# EasyEDA Pro project ProPrj_MegaPocket_2025-07-17.epro, schematic Schematic1
Board Name: PCB2; Create Date: 2025-07-09; Page Name: P1; Project Name: MegaPocket_2025-05-22; Schematic Name: Schematic1; Update Date: 2025-07-10; Version: V2.0
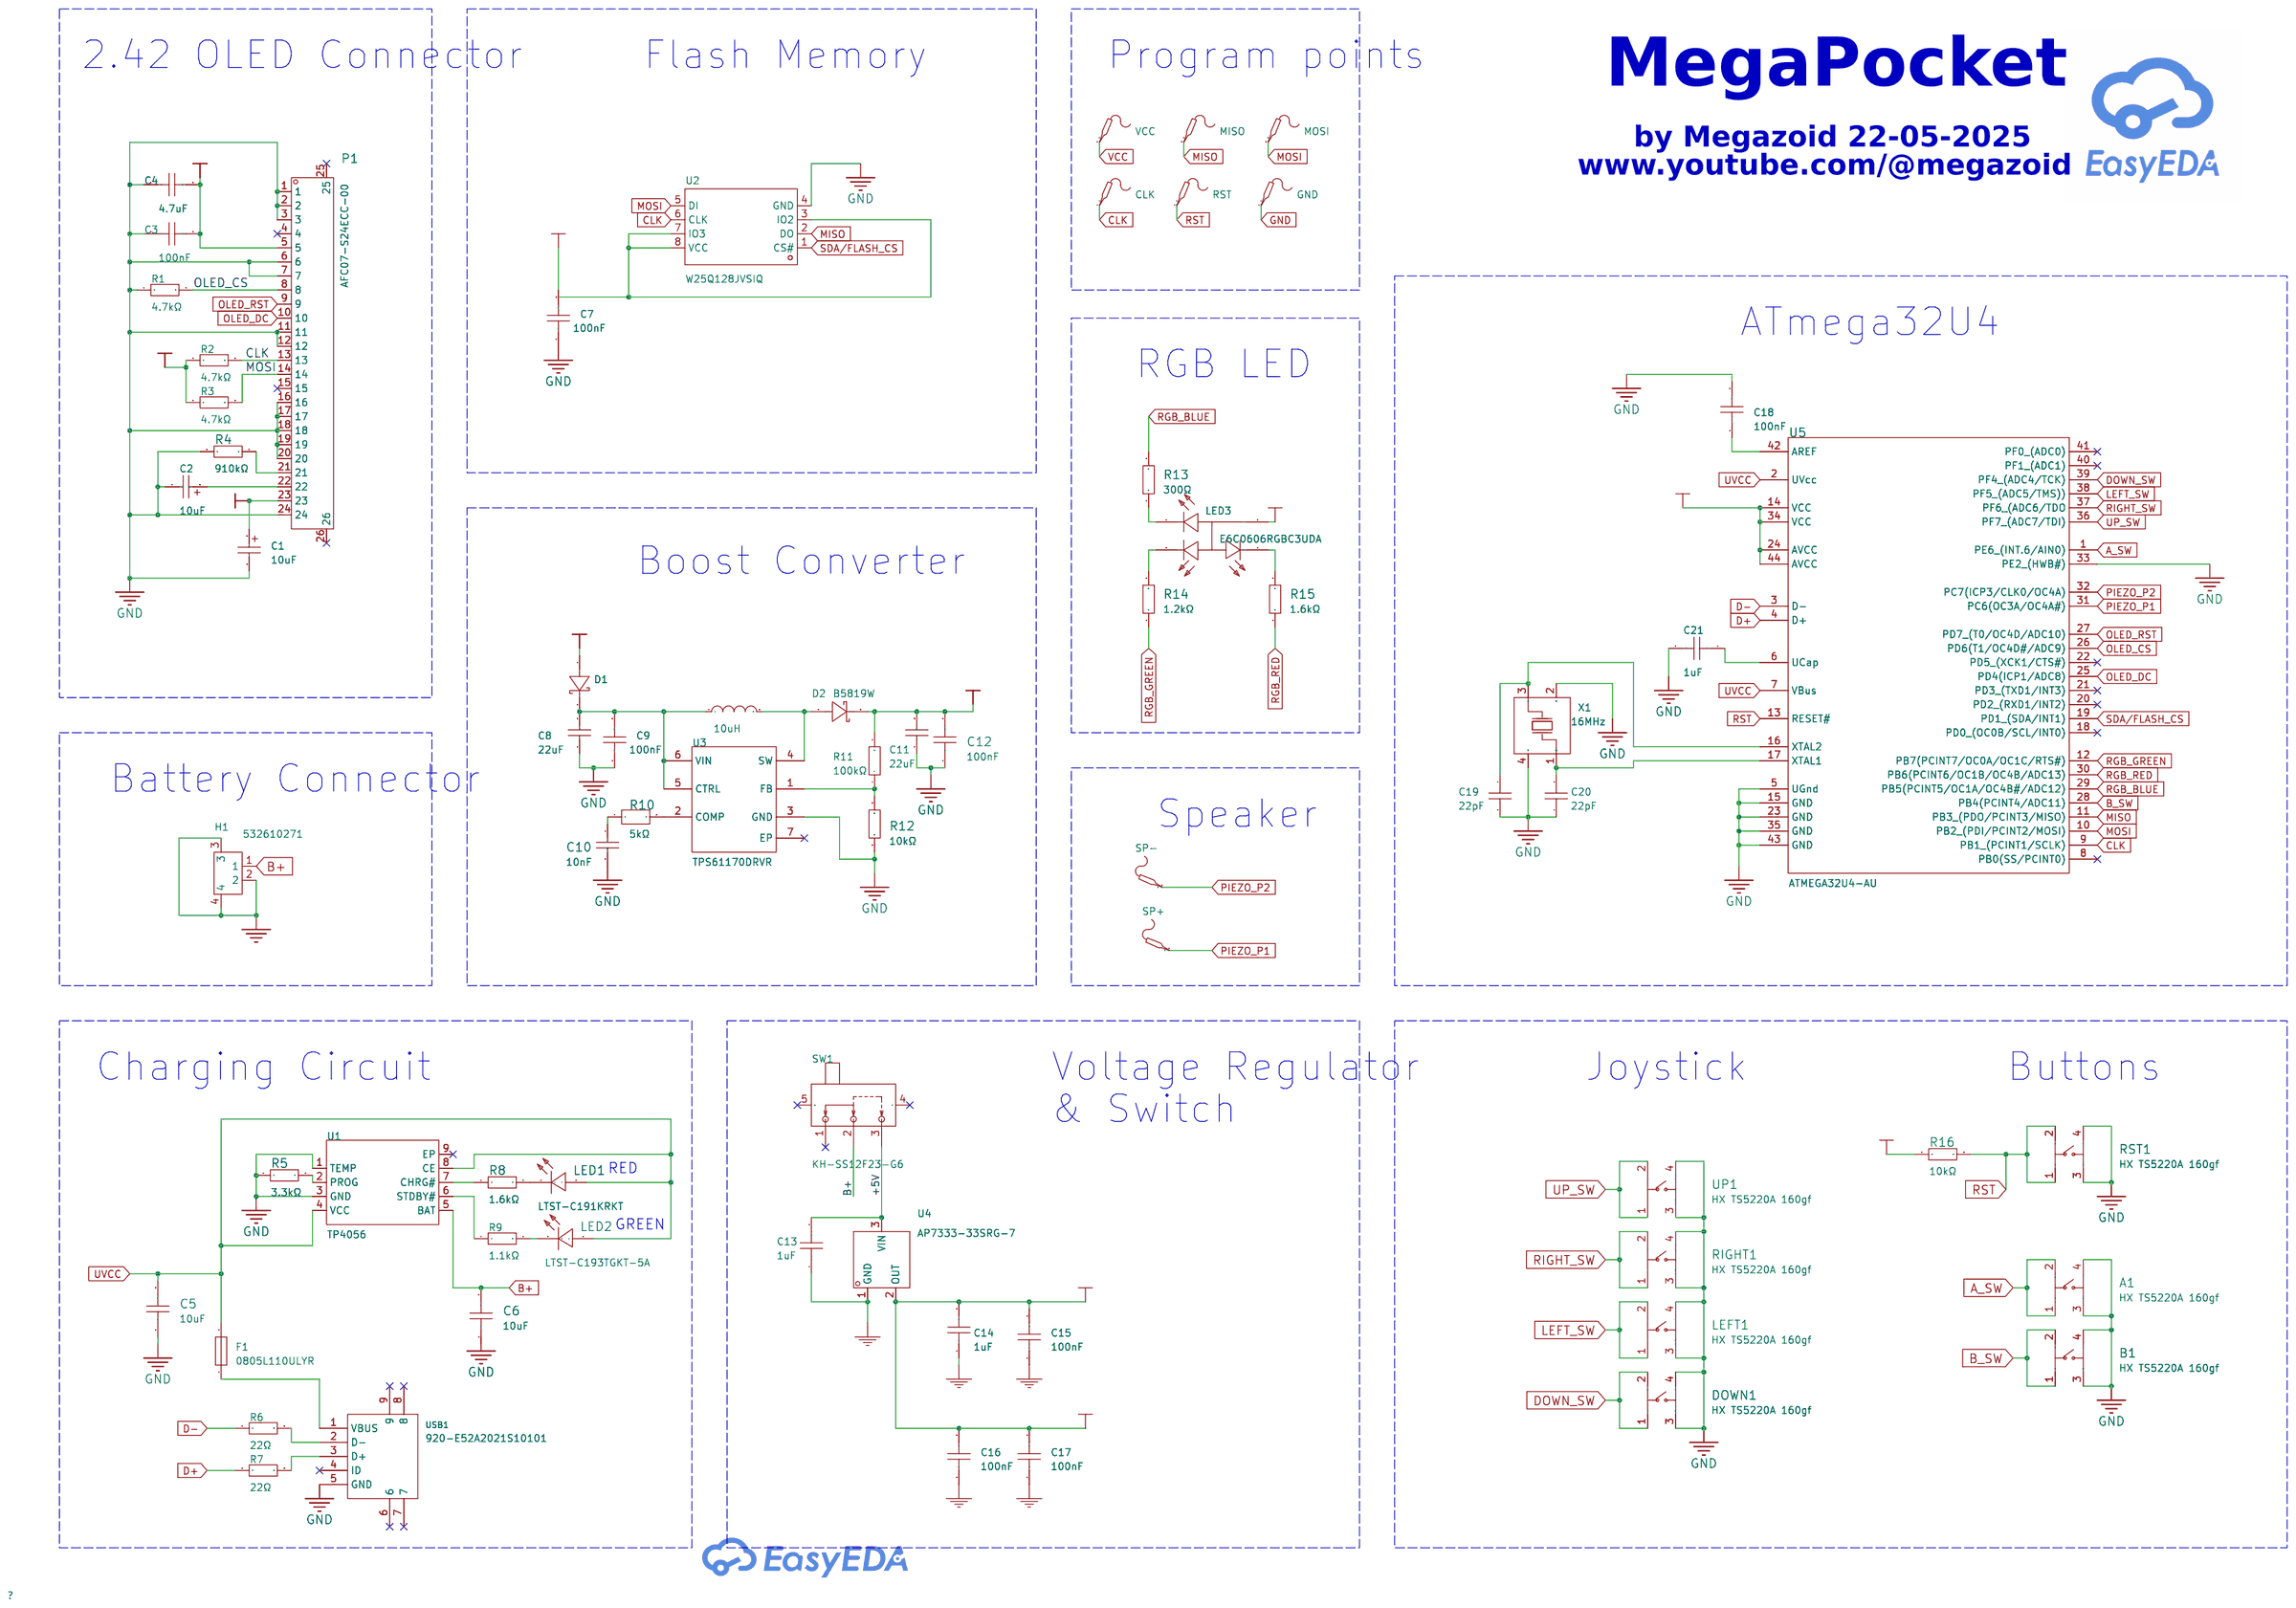
[diagram p0: schematic sheet]

## Parts
A1  HX TS5220A 160gf  [SW-SMD_4P-L5.2-W5.2-P3.70-LS6.4]
B1  HX TS5220A 160gf  [SW-SMD_4P-L5.2-W5.2-P3.70-LS6.4]
C1  10uF  [CASE-C_6032]
C2  10uF  [CASE-C_6032]
C3  100nF  [C0603]
C4  4.7uF  [C0603]
C5  10uF  [C0603]
C6  10uF  [C0603]
C7  100nF  [C0603]
C8  22uF  [C0805]
C9  100nF  [C0603]
C10  10nF  [C0603]
C11  22uF  [C0805]
C12  100nF  [C0805]
C13  1uF  [C0603]
C14  1uF  [C0603]
C15  100nF  [C0603]
C16  100nF  [C0603]
C17  100nF  [C0603]
C18  100nF  [C0603]
C19  22pF  [C0603]
C20  22pF  [C0603]
C21  1uF  [C0603]
CLK  CLK  [Test-Point-0.5mm]
D1  B5819W  [SOD-123_L2.8-W1.8-LS3.7-FD-1]
D2  B5819W  [SOD-123_L2.8-W1.8-LS3.7-FD-1]
DOWN1  HX TS5220A 160gf  [SW-SMD_4P-L5.2-W5.2-P3.70-LS6.4]
F1  0805L110ULYR  [F0805]
GND  GND  [Test-Point-0.5mm]
H1  532610271  [CONN-SMD_532610271]
L3  10uH  [IND-SMD_L3.2-W2.5]
LED1  LTST-C191KRKT  [LED0603-RD]
LED2  LTST-C193TGKT-5A  [LED0603-RD]
LED3  E6C0606RGBC3UDA  [LED-ARRAY-SMD_4P-L1.6-W1.6_SY-PB2333RGBC-010F]
LEFT1  HX TS5220A 160gf  [SW-SMD_4P-L5.2-W5.2-P3.70-LS6.4]
MISO  MISO  [Test-Point-0.5mm]
MOSI  MOSI  [Test-Point-0.5mm]
P1  AFC07-S24ECC-00  [FPC-SMD_24P-L17.5-W5.4-P0.50]
R1  4.7kΩ  [R0603]
R2  4.7kΩ  [R0603]
R3  4.7kΩ  [R0603]
R4  910kΩ  [R0603]
R5  3.3kΩ  [R0603]
R6  22Ω  [R0603]
R7  22Ω  [R0603]
R8  1.6kΩ  [R0603]
R9  1.1kΩ  [R0603]
R10  5kΩ  [R0603]
R11  100kΩ  [R0603]
R12  10kΩ  [R0603]
R13  300Ω  [R0603]
R14  1.2kΩ  [R0603]
R15  1.6kΩ  [R0603]
R16  10kΩ  [R0603]
RIGHT1  HX TS5220A 160gf  [SW-SMD_4P-L5.2-W5.2-P3.70-LS6.4]
RST  RST  [Test-Point-0.5mm]
RST1  HX TS5220A 160gf  [SW-SMD_4P-L5.2-W5.2-P3.70-LS6.4]
SP+  -  [Test-Point-0.5mm]
SP-  -  [Test-Point-0.5mm]
SW1  KH-SS12F23-G6  [SW-TH_KH-SS12F23-G6]
U1  TP4056  [ESOP-8_L4.9-W3.9-P1.27-LS6.0-BL-EP]
U2  W25Q128JVSIQ  [SOIC-8_L5.3-W5.3-P1.27-LS8.0-BL]
U3  TPS61170DRVR  [QFN-6_L2.0-W2.0-P0.65-TL-EP]
U4  AP7333-33SRG-7  [SOT-23-3_L2.9-W1.3-P1.90-LS2.4-BR]
U5  ATMEGA32U4-AU  [QFP-44_L10.0-W10.0-P0.80-LS13.2-BL]
UP1  HX TS5220A 160gf  [SW-SMD_4P-L5.2-W5.2-P3.70-LS6.4]
USB1  920-E52A2021S10101  [MICRO-USB_MICRO-USB-30]
VCC  VCC  [Test-Point-0.5mm]
X1  16MHz  [CRYSTAL-SMD_4P-L3.2-W2.5-BL]

## Library data of the parts
A1 B1 DOWN1 LEFT1 RIGHT1 RST1 UP1 = HX TS5220A 160gf: Circuit:SPST Actuator Style:Round Button Operating Force:160gf Mounting Style:Brick nogging Switch Length:5.2mm Switch Width:5.2mm Switch Height:2mm Strike Gundam:- Contact Current:50mA Voltage Rating (AC):- Voltage Rating (DC):12V Power Rating:- Insulati; LCSC Part Name: 轻触开关贴片 5.2x5.2x2.0mm 铜头按键开关 160gf 立式开关; Supplier Part: C5340185; Manufacturer: hanxia(韩下); Supplier Footprint: SMD; JLCPCB Part Class: Extended Part; Datasheet: https://atta.szlcsc.com/upload/public/pdf/source/20221227/25A60DA11CC8B8803467471F4E33DC0A.pdf; Supplier: LCSC; Circuit: SPST; Actuator Style: Round Button; Operating Force: 160gf; Mounting Style: Brick nogging; Switch Length: 5.2mm; Switch Width: 5.2mm; Switch Height: 2mm; Contact Current: 50mA; Voltage Rating (DC): 12V; Insulation Resistance: 100MΩ; Actuator/Cap Color: 金色; With Lamp: No; Mechanical Life: 10万次; Operating Temperature: -25℃~+70℃
C1 C2 = 593D106X9025C2TE3: Capacitance: Tolerance:±10% Tolerance:±10% Rated Voltage: Equivalent Series Resistance(ESR):450mΩ@100kHz Operating Temperature:-55℃~+125℃ Operating Temperature:-55℃~+125℃; LCSC Part Name: 10uF ±10% 25V; Supplier Part: C132690; Manufacturer: VISHAY(威世); Supplier Footprint: CASE-C-6032; JLCPCB Part Class: Extended Part; Datasheet: https://atta.szlcsc.com/upload/public/pdf/source/20171113/C139562_15105612598411115716.pdf; Supplier: LCSC; Tolerance: ±10%; Equivalent Series Resistance(ESR): 450mΩ@100kHz; Operating Temperature: -55℃~+125℃
C3 C7 C9 C15-C18 = CC0603KRX7R9BB104: Capacitance:100nF Tolerance:±10% Tolerance:±10% Voltage Rating:50V Temperature Coefficient:X7R; LCSC Part Name: 100nF ±10% 50V; Supplier Part: C14663; Manufacturer: YAGEO(国巨); Supplier Footprint: 0603; JLCPCB Part Class: Basic Part; Datasheet: https://atta.szlcsc.com/upload/public/pdf/source/20180910/C282072_33301C7F631E79921B82A8DAC6BCC5B3.pdf; Supplier: LCSC; Tolerance: ±10%; Voltage Rating: 50V; Temperature Coefficient: X7R
C4 = CL10A475KO8NNNC: Capacitance: Tolerance:±10% Tolerance:±10% Voltage Rated: Temperature Coefficient:; LCSC Part Name: 4.7uF ±10% 16V; Supplier Part: C19666; Manufacturer: SAMSUNG(三星); Supplier Footprint: 0603; JLCPCB Part Class: Basic Part; Datasheet: https://atta.szlcsc.com/upload/public/pdf/source/20160218/1457707763339.pdf; Supplier: LCSC; Tolerance: ±10%
C5 C6 = CL10A106MQ8NNNC: Capacitance: Tolerance:±20% Tolerance:±20% Voltage Rated: Temperature Coefficient:; LCSC Part Name: 10uF ±20% 6.3V; Supplier Part: C1691; Manufacturer: SAMSUNG(三星); Supplier Footprint: 0603; JLCPCB Part Class: Extended Part; Datasheet: https://atta.szlcsc.com/upload/public/pdf/source/20160218/1457707763339.pdf; Supplier: LCSC; Tolerance: ±20%
C8 C11 = GRM21BR61E226ME44L: Capacitance: Tolerance:±20% Tolerance:±20% Voltage Rated: Temperature Coefficient:; LCSC Part Name: 22uF ±20% 25V; Supplier Part: C86816; Manufacturer: muRata(村田); Supplier Footprint: 0805; JLCPCB Part Class: Extended Part; Datasheet: https://atta.szlcsc.com/upload/public/pdf/source/20161226/1482720145536.pdf; Supplier: LCSC; Tolerance: ±20%
C10 = CC0603KRX7R9BB103: Capacitance: Tolerance:±10% Tolerance:±10% Voltage Rated: Temperature Coefficient:; LCSC Part Name: 10nF ±10% 50V; Supplier Part: C100042; Manufacturer: YAGEO(国巨); Supplier Footprint: 0603; JLCPCB Part Class: Extended Part; Datasheet: https://atta.szlcsc.com/upload/public/pdf/source/20181008/C309510_22F155564471FAF6A489F7D68F34234E.pdf; Supplier: LCSC; Tolerance: ±10%
C12 = GCM21BR91H104KA37L: Capacitance: Tolerance:±10% Tolerance:±10% Voltage Rated: Temperature Coefficient:; LCSC Part Name: 100nF ±10% 50V; Supplier Part: C161269; Manufacturer: muRata(村田); Supplier Footprint: 0805; JLCPCB Part Class: Extended Part; Datasheet: https://atta.szlcsc.com/upload/public/pdf/source/20180821/C161269_DE11C31B67E3684A438DEC67F9BEE3D5.pdf; Supplier: LCSC; Tolerance: ±10%
C13 C14 C21 = CL10A105KB8NNNC: Capacitance: Tolerance:±10% Tolerance:±10% Voltage Rated: Temperature Coefficient:; LCSC Part Name: 1uF ±10% 50V; Supplier Part: C15849; Manufacturer: SAMSUNG(三星); Supplier Footprint: 0603; JLCPCB Part Class: Basic Part; Datasheet: https://atta.szlcsc.com/upload/public/pdf/source/20160218/1457707763339.pdf; Supplier: LCSC; Tolerance: ±10%
C19 C20 = CL10C220JB8NNNC: Capacitance: Tolerance:±5% Tolerance:±5% Voltage Rated: Temperature Coefficient:; LCSC Part Name: 22pF ±5% 50V; Supplier Part: C1653; Manufacturer: SAMSUNG(三星); Supplier Footprint: 0603; JLCPCB Part Class: Basic Part; Datasheet: https://atta.szlcsc.com/upload/public/pdf/source/20160218/1457707763339.pdf; Supplier: LCSC; Tolerance: ±5%
CLK GND MISO MOSI RST SP+ SP- VCC = Test-Point: Test Point 测试点
D1 D2 = B5819W_C908224: Diode Configuration:- Forward Voltage (Vf@If):900mV@3A Reverse Voltage (Vr):40V Rectified Current:1A Reverse Leakage Current (Ir):1mA@40V; LCSC Part Name: 电压:40V 电流:1A; Supplier Part: C908224; Manufacturer: FUXINSEMI(富芯森美); Supplier Footprint: SOD-123; JLCPCB Part Class: Extended Part; Datasheet: https://atta.szlcsc.com/upload/public/pdf/source/20201027/C908224_73D10151B1A2DD88F16405F55CA93B30.pdf; Supplier: LCSC; Forward Voltage (Vf@If): 900mV@3A; Reverse Voltage (Vr): 40V; Rectified Current: 1A; Reverse Leakage Current (Ir): 1mA@40V
F1 = 0805L110ULYR: Voltage - Max:6V Current - Max:50A Hold Current:1.1A Trip Current:1.8A Power Dissipation:600mW Resistance - Initial (Ri) (Min):40mΩ Resistance - Post Trip (R1) (Max):120mΩ Time to Trip(Max):300ms Operating Temperature:-40℃~+85℃ Operating Temperature:-40℃~; LCSC Part Name: 6V 1.1A 0805自恢复; Supplier Part: C468888; Manufacturer: Littelfuse(美国力特); Supplier Footprint: 0805; JLCPCB Part Class: Extended Part; Datasheet: https://atta.szlcsc.com/upload/public/pdf/source/20200415/C468888_7771F634929FCA057CA94F4718F9131E.pdf; Supplier: LCSC; Voltage - Max: 6V; Current - Max: 50A; Hold Current: 1.1A; Trip Current: 1.8A; Power Dissipation: 600mW; Resistance - Initial (Ri) (Min): 40mΩ; Resistance - Post Trip (R1) (Max): 120mΩ; Time to Trip(Max): 300ms; Operating Temperature: -40℃~+85℃
H1 = 532610271_C177225: Pins Structure:1x2P Pitch:1.25mm Mounting Style:Horizontal attachment Reference Series:PicoBlade(MX 1.25) Number of Pins:2P Number of Rows:1 Number of PINs Per Row:2 Row Spacing:- Current Rating (Max):1A Contact Material:Phosphor Bronze Contact Plating:Ti; LCSC Part Name: 1x2P 间距:1.25mm 卧贴 系列:PicoBlade(MX 1.25); Supplier Part: C177225; Manufacturer: MOLEX; Supplier Footprint: SMD,P=1.25mm; JLCPCB Part Class: Extended Part; Supplier: LCSC; Pins Structure: 1x2P; Pitch: 1.25mm; Mounting Style: Horizontal attachment; Reference Series: PicoBlade(MX 1.25); Number of Pins: 2P; Number of Rows: 1; Number of PINs Per Row: 2; Current Rating (Max): 1A; Contact Material: Phosphor Bronze; Contact Plating: Tin; Operating Temperature Range: -40℃~+105℃; Rated Voltage (Max): 125V; Plastic Material: 玻纤增强PA; Flame Retardant Rating: UL94V-0; Supplementary Features: Auxiliary soldering legs; Colour: White; Z-Height of the Board: 3.4mm; X-Length of Bottom Edge on Board (Spacing Line): 7.65mm; Y-Width of Bottom Edge on Board: 5.2mm
L3 = SCW3225H100KTT: Inductance:10uH Tolerance:±10% Tolerance:±10% Current Rating:220mA Current - Saturation (Isat):- DC Resistance(DCR):1.105Ω Q @ Frequency:15@2.52MHz Frequency - Self Resonant:28MHz Ratings:-; LCSC Part Name: 10uH ±10%; Supplier Part: C2842780; Manufacturer: Sunltech(顺磁); Supplier Footprint: 1210; JLCPCB Part Class: Extended Part; Datasheet: https://atta.szlcsc.com/upload/public/pdf/source/20210712/C2842778_179993D9FAB334025CFF2EB6D81BA0BE.pdf; Supplier: LCSC; Tolerance: ±10%; Current Rating: 220mA; DC Resistance(DCR): 1.105Ω; Q @ Frequency: 15@2.52MHz; Frequency - Self Resonant: 28MHz
LED1 = LTST-C191KRKT: Emitted Color:Red Forward Voltage (VF):2V Forward Voltage (VF):2V Power Dissipation:75mW Forward Current:20mA Dominant Wavelength:631nm Dominant Wavelength:631nm Peak Wavelength:639nm Diode Configuration:- Lens Color:无色透明透镜 Color Temperature:- Color Tempe; LCSC Part Name: 红灯; Supplier Part: C125099; Manufacturer: LITEON(光宝); Supplier Footprint: 0603; JLCPCB Part Class: Extended Part; Datasheet: https://atta.szlcsc.com/upload/public/pdf/source/20180129/C125099_15171878294931315872.pdf; Supplier: LCSC; Emitted Color: Red; Forward Voltage (VF): 2V; Power Dissipation: 75mW; Forward Current: 20mA; Dominant Wavelength: 631nm; Peak Wavelength: 639nm; Lens Color: 无色透明透镜; Luminous Intensity: 54mcd; Viewing Angle: 130°; Operating Temperature: -55℃~+85℃
LED2 = LTST-C193TGKT-5A: Emitted Color:Emerald Forward Voltage (VF):2.8V Forward Voltage (VF):2.8V Power Dissipation:76mW Forward Current:5mA Dominant Wavelength:520nm~535nm Dominant Wavelength:520nm~535nm Peak Wavelength:525nm Diode Configuration:- Lens Color:无色透明透镜 Color Temper; Supplier Part: C12065; Manufacturer: LITEON(光宝); Supplier Footprint: 0603; JLCPCB Part Class: Extended Part; Datasheet: https://atta.szlcsc.com/upload/public/pdf/source/20140530/1457707085588.pdf; Supplier: LCSC; Emitted Color: Emerald; Forward Voltage (VF): 2.8V; Power Dissipation: 76mW; Forward Current: 5mA; Dominant Wavelength: 520nm~535nm; Peak Wavelength: 525nm; Lens Color: 无色透明透镜; Luminous Intensity: 154mcd; Viewing Angle: 130°; Operating Temperature: -20℃~+80℃
LED3 = E6C0606RGBC3UDA: LCSC Part Name: RGB三色; Supplier Part: C375569; Manufacturer: ekinglux(亿晶源); Supplier Footprint: SMD-4P,1.6x1.6mm; JLCPCB Part Class: Extended Part; Datasheet: https://atta.szlcsc.com/upload/public/pdf/source/20220330/8DE12FB9881A833E867FD7AF6894B416.pdf; Supplier: LCSC
P1 = AFC07-S24ECC-00: Locking Feature:抽屉式 Contact Type:Contact,Top Number of Contacts:24P Pitch:0.5mm Mounting Type:卧贴 FFC, FCB Thickness:0.3mm FFC, FCB Thickness:0.3mm Height Above Board:2mm; LCSC Part Name: 间距:0.5mm P数:24P 抽屉式 上接; Supplier Part: C11092; Manufacturer: JS(钜硕电子); Supplier Footprint: SMD,P=0.5mm,卧贴; JLCPCB Part Class: Extended Part; Datasheet: https://atta.szlcsc.com/upload/public/pdf/source/20151024/1457707484416.pdf; Supplier: LCSC; Locking Feature: 抽屉式; Contact Type: Contact,Top; Number of Contacts: 24P; Pitch: 0.5mm; Mounting Type: 卧贴; FFC, FCB Thickness: 0.3mm; Height Above Board: 2mm
R1-R3 = 0603WAF4701T5E: Type:Thick Film Resistors Resistance:4.7kΩ Tolerance:±1% Tolerance:±1% Power(Watts): Overload Voltage (Max): Temperature Coefficient:±100ppm/℃ Temperature Coefficient:±100ppm/℃ Operating Temperature Range:-55℃~+155℃ Operating Temperature Range:-55℃~+155℃; LCSC Part Name: 4.7kΩ ±1% 100mW 厚膜电阻; Supplier Part: C23162; Manufacturer: UNI-ROYAL(厚声); Supplier Footprint: 0603; JLCPCB Part Class: Basic Part; Datasheet: https://atta.szlcsc.com/upload/public/pdf/source/20200306/C422600_1E6D84923E4A46A82E41ADD87F860B5C.pdf; Supplier: LCSC; Type: Thick Film Resistors; Tolerance: ±1%; Temperature Coefficient: ±100ppm/℃; Operating Temperature Range: -55℃~+155℃
R4 = 0603WAF9103T5E: Type:Thick Film Resistors Resistance:910kΩ Tolerance:±1% Tolerance:±1% Power(Watts): Overload Voltage (Max): Temperature Coefficient:±100ppm/℃ Temperature Coefficient:±100ppm/℃ Operating Temperature Range:-55℃~+155℃ Operating Temperature Range:-55℃~+155℃; LCSC Part Name: 910kΩ ±1% 100mW 厚膜电阻; Supplier Part: C23263; Manufacturer: UNI-ROYAL(厚声); Supplier Footprint: 0603; JLCPCB Part Class: Extended Part; Datasheet: https://atta.szlcsc.com/upload/public/pdf/source/20200306/C422600_1E6D84923E4A46A82E41ADD87F860B5C.pdf; Supplier: LCSC; Type: Thick Film Resistors; Tolerance: ±1%; Temperature Coefficient: ±100ppm/℃; Operating Temperature Range: -55℃~+155℃
R5 = 0603WAF3301T5E: Type:Thick Film Resistors Resistance:3.3kΩ Tolerance:±1% Tolerance:±1% Power(Watts): Overload Voltage (Max): Temperature Coefficient:±100ppm/℃ Temperature Coefficient:±100ppm/℃ Operating Temperature Range:-55℃~+155℃ Operating Temperature Range:-55℃~+155℃; LCSC Part Name: 3.3kΩ ±1% 100mW 厚膜电阻; Supplier Part: C22978; Manufacturer: UNI-ROYAL(厚声); Supplier Footprint: 0603; JLCPCB Part Class: Basic Part; Datasheet: https://atta.szlcsc.com/upload/public/pdf/source/20200306/C422600_1E6D84923E4A46A82E41ADD87F860B5C.pdf; Supplier: LCSC; Type: Thick Film Resistors; Tolerance: ±1%; Temperature Coefficient: ±100ppm/℃; Operating Temperature Range: -55℃~+155℃
R6 R7 = 0603WAF220JT5E: Type:Thick Film Resistors Resistance:22Ω Tolerance:±1% Tolerance:±1% Power(Watts): Overload Voltage (Max): Temperature Coefficient:±100ppm/℃ Temperature Coefficient:±100ppm/℃ Operating Temperature Range:-55℃~+155℃ Operating Temperature Range:-55℃~+155℃; LCSC Part Name: 22Ω ±1% 100mW 厚膜电阻; Supplier Part: C23345; Manufacturer: UNI-ROYAL(厚声); Supplier Footprint: 0603; JLCPCB Part Class: Basic Part; Datasheet: https://atta.szlcsc.com/upload/public/pdf/source/20200306/C422600_1E6D84923E4A46A82E41ADD87F860B5C.pdf; Supplier: LCSC; Type: Thick Film Resistors; Tolerance: ±1%; Temperature Coefficient: ±100ppm/℃; Operating Temperature Range: -55℃~+155℃
R8 R15 = 0603WAF1601T5E: Type:Thick Film Resistors Resistance:1.6kΩ Tolerance:±1% Tolerance:±1% Power(Watts): Overload Voltage (Max): Temperature Coefficient:±100ppm/℃ Temperature Coefficient:±100ppm/℃ Operating Temperature Range:-55℃~+155℃ Operating Temperature Range:-55℃~+155℃; LCSC Part Name: 1.6kΩ ±1% 100mW 厚膜电阻; Supplier Part: C22847; Manufacturer: UNI-ROYAL(厚声); Supplier Footprint: 0603; JLCPCB Part Class: Extended Part; Datasheet: https://atta.szlcsc.com/upload/public/pdf/source/20200306/C422600_1E6D84923E4A46A82E41ADD87F860B5C.pdf; Supplier: LCSC; Type: Thick Film Resistors; Tolerance: ±1%; Temperature Coefficient: ±100ppm/℃; Operating Temperature Range: -55℃~+155℃
R9 = 0603WAF1101T5E: Type:Thick Film Resistors Resistance:1.1kΩ Tolerance:±1% Tolerance:±1% Power(Watts): Overload Voltage (Max): Temperature Coefficient:±100ppm/℃ Temperature Coefficient:±100ppm/℃ Operating Temperature Range:-55℃~+155℃ Operating Temperature Range:-55℃~+155℃; LCSC Part Name: 1.1kΩ ±1% 100mW 厚膜电阻; Supplier Part: C22764; Manufacturer: UNI-ROYAL(厚声); Supplier Footprint: 0603; JLCPCB Part Class: Extended Part; Datasheet: https://atta.szlcsc.com/upload/public/pdf/source/20200306/C422600_1E6D84923E4A46A82E41ADD87F860B5C.pdf; Supplier: LCSC; Type: Thick Film Resistors; Tolerance: ±1%; Temperature Coefficient: ±100ppm/℃; Operating Temperature Range: -55℃~+155℃
R10 = RTT035001FTP: Type:Thick Film Resistors Resistance: Tolerance:±1% Tolerance:±1% Power(Watts): Overload Voltage (Max): Temperature Coefficient:±100ppm/℃ Temperature Coefficient:±100ppm/℃ Operating Temperature Range:-55℃~+155℃ Operating Temperature Range:-55℃~+155℃; LCSC Part Name: 厚膜电阻 5kΩ ±1% 100mW; Supplier Part: C166926; Manufacturer: RALEC(旺诠); Supplier Footprint: 0603; JLCPCB Part Class: Extended Part; Datasheet: https://atta.szlcsc.com/upload/public/pdf/source/20180928/C303758_52AE496EA05AD4D633595C32F5A0EBAF.pdf; Supplier: LCSC; Type: Thick Film Resistors; Tolerance: ±1%; Temperature Coefficient: ±100ppm/℃; Operating Temperature Range: -55℃~+155℃
R11 = 0603WAF1003T5E: Type:Thick Film Resistors Resistance:100kΩ Tolerance:±1% Tolerance:±1% Power(Watts): Overload Voltage (Max): Temperature Coefficient:±100ppm/℃ Temperature Coefficient:±100ppm/℃ Operating Temperature Range:-55℃~+155℃ Operating Temperature Range:-55℃~+155℃; LCSC Part Name: 100kΩ ±1% 100mW 厚膜电阻; Supplier Part: C25803; Manufacturer: UNI-ROYAL(厚声); Supplier Footprint: 0603; JLCPCB Part Class: Basic Part; Datasheet: https://atta.szlcsc.com/upload/public/pdf/source/20200306/C422600_1E6D84923E4A46A82E41ADD87F860B5C.pdf; Supplier: LCSC; Type: Thick Film Resistors; Tolerance: ±1%; Temperature Coefficient: ±100ppm/℃; Operating Temperature Range: -55℃~+155℃
R12 R16 = 0603WAF1002T5E: Type:Thick Film Resistor Resistance:10kΩ Tolerance:±1% Tolerance:±1% Power(Watts):100mW Voltage-Supply(Max):75V Temperature Coefficient:±100ppm/℃ Temperature Coefficient:±100ppm/℃ Operating Temperature:-55℃~+155℃ Operating Temperature:-55℃~+155℃; LCSC Part Name: 厚膜电阻 10kΩ ±1% 100mW; Supplier Part: C25804; Manufacturer: UNI-ROYAL(厚声); Supplier Footprint: 0603; JLCPCB Part Class: Basic Part; Datasheet: https://atta.szlcsc.com/upload/public/pdf/source/20200306/C422600_1E6D84923E4A46A82E41ADD87F860B5C.pdf; Supplier: LCSC; Type: Thick Film Resistor; Tolerance: ±1%; Power(Watts): 100mW; Voltage-Supply(Max): 75V; Temperature Coefficient: ±100ppm/℃; Operating Temperature: -55℃~+155℃
R13 = 0603WAF3000T5E: Type:Thick Film Resistors Resistance: Tolerance:±1% Tolerance:±1% Power(Watts): Overload Voltage (Max): Temperature Coefficient:±100ppm/℃ Temperature Coefficient:±100ppm/℃ Operating Temperature Range:-55℃~+155℃ Operating Temperature Range:-55℃~+155℃; LCSC Part Name: 300Ω ±1% 100mW 厚膜电阻; Supplier Part: C23025; Manufacturer: UNI-ROYAL(厚声); Supplier Footprint: 0603; JLCPCB Part Class: Basic Part; Datasheet: https://atta.szlcsc.com/upload/public/pdf/source/20200306/C422600_1E6D84923E4A46A82E41ADD87F860B5C.pdf; Supplier: LCSC; Type: Thick Film Resistors; Tolerance: ±1%; Temperature Coefficient: ±100ppm/℃; Operating Temperature Range: -55℃~+155℃
R14 = 0603WAF1201T5E: Type:Thick Film Resistors Resistance:1.2kΩ Tolerance:±1% Tolerance:±1% Power(Watts): Overload Voltage (Max): Temperature Coefficient:±100ppm/℃ Temperature Coefficient:±100ppm/℃ Operating Temperature Range:-55℃~+155℃ Operating Temperature Range:-55℃~+155℃; LCSC Part Name: 1.2kΩ ±1% 100mW 厚膜电阻; Supplier Part: C22765; Manufacturer: UNI-ROYAL(厚声); Supplier Footprint: 0603; JLCPCB Part Class: Basic Part; Datasheet: https://atta.szlcsc.com/upload/public/pdf/source/20200306/C422600_1E6D84923E4A46A82E41ADD87F860B5C.pdf; Supplier: LCSC; Type: Thick Film Resistors; Tolerance: ±1%; Temperature Coefficient: ±100ppm/℃; Operating Temperature Range: -55℃~+155℃
SW1 = KH-SS12F23-G6: LCSC Part Name: 拨动开关 KH-SS12F23-G6; Supplier Part: C5274466; Manufacturer: kinghelm(金航标); Supplier Footprint: 插件; JLCPCB Part Class: Extended Part; Datasheet: https://atta.szlcsc.com/upload/public/pdf/source/20221118/BFF37B84B5CB1A55659AB56BFB65BEAA.pdf; Supplier: LCSC
U1 = TP4056_C725790: Supplier Part: C725790; Manufacturer: UMW(友台半导体); Supplier Footprint: ESOP-8; JLCPCB Part Class: Extended Part; Datasheet: https://atta.szlcsc.com/upload/public/pdf/source/20231109/CF74897CE79A500F7FE27A45ADCCC631.pdf; Supplier: LCSC
U2 = W25Q128JVSIQ: Interface Type:SPI Memory Size:128Mbit Clock Frequency (fc):133MHz Supply Voltage:2.7V~3.6V Supply Voltage:2.7V~3.6V Page Programming Time (Tpp):700us Block Erase Time (tBE):120ms@(32KB) Data Retention - TDR (Year):20 years Operating Temperature:-40℃~+85℃; LCSC Part Name: W25Q128JVSIQ 编带; Supplier Part: C97521; Manufacturer: WINBOND(华邦); Supplier Footprint: SOIC-8-208mil; JLCPCB Part Class: Basic Part; Datasheet: https://atta.szlcsc.com/upload/public/pdf/source/20170316/1489627409956.pdf; Supplier: LCSC; Interface Type: SPI; Memory Size: 128Mbit; Clock Frequency (fc): 133MHz; Supply Voltage: 2.7V~3.6V; Page Programming Time (Tpp): 700us; Block Erase Time (tBE): 120ms@(32KB); Data Retention - TDR (Year): 20 years; Operating Temperature: -40℃~+85℃
U3 = TPS61170DRVR: Function:Boost type Output Type:Adjustable Input Voltage:3V~18V Input Voltage:3V~18V Output Voltage:3V~38V Output Voltage:3V~38V Output Current:- Switching Frequency:1.2MHz Switching Frequency:1.2MHz Operating Temperature:-40℃~+85℃@(TA) Operating Temperat; LCSC Part Name: 1.2A高压升压转换器; Supplier Part: C15163; Manufacturer: TI(德州仪器); Supplier Footprint: WSON-6(2x2); JLCPCB Part Class: Extended Part; Datasheet: https://www.ti.com/cn/lit/gpn/tps61170; Supplier: LCSC; Function: Boost type; Output Type: Adjustable; Input Voltage: 3V~18V; Output Voltage: 3V~38V; Switching Frequency: 1.2MHz; Operating Temperature: -40℃~+85℃@(TA); Synchronous Rectification: No; Number of Outputs: 1; Topology: Boost; Switch tube (built-in/external): Built-in
U4 = AP7333-33SRG-7: Output Type:Fixed Maximum Input Voltage:6V Output Voltage:3.3V Output Voltage:3.3V Output Current:300mA Power Supply Rejection Ratio (PSRR):65dB@(100Hz) Dropout Voltage:550mV@(300mA) standby current:75uA Feature:Low ESR；Thermal Protection(TSD)；Overcurrent; LCSC Part Name: 输入6V 输出3.3V 300mA; Supplier Part: C150745; Manufacturer: DIODES(美台); Supplier Footprint: SOT-23; JLCPCB Part Class: Extended Part; Datasheet: https://atta.szlcsc.com/upload/public/pdf/source/20181012/C90469_7F4D66E4C0CC7AC9A9A603D01EA795C2.pdf; Supplier: LCSC; Output Type: Fixed; Maximum Input Voltage: 6V; Output Voltage: 3.3V; Output Current: 300mA; Power Supply Rejection Ratio (PSRR): 65dB@(100Hz); Dropout Voltage: 550mV@(300mA); standby current: 75uA; Feature: Low ESR；Thermal Protection(TSD)；Overcurrent Protection(OCP)；Short-Circuit  Protection; Operating Temperature: -40℃~+85℃; Output Polarity: Positive electrode; Number of Outputs: 1
U5 = ATMEGA32U4-AU: CPU Core:AVR CPU Maximum Speed:16MHz Program Storage Size:32KB Program Memory Type:FLASH EEPROM:1KB Number of I/O:26 ADC (Bit):10bit Voltage - Supply:2.7V~5.5V Voltage - Supply:2.7V~5.5V; Supplier Part: C44854; Manufacturer: MICROCHIP(美国微芯); Supplier Footprint: QFP-44(10x10); JLCPCB Part Class: Extended Part; Datasheet: https://atta.szlcsc.com/upload/public/pdf/source/20150407/1457707275091.pdf; Supplier: LCSC; CPU Core: AVR; CPU Maximum Speed: 16MHz; Program Storage Size: 32KB; Program Memory Type: FLASH; EEPROM: 1KB; Number of I/O: 26; ADC (Bit): 10bit; Voltage - Supply: 2.7V~5.5V
USB1 = 920-E52A2021S10101: Connector Type:Micro-B Standard:USB 2.0 Gender:Female Number of Ports:1 Number of Contacts:5P; LCSC Part Name: Micro-B 母; Supplier Part: C40946; Manufacturer: 精拓金; Supplier Footprint: SMD; JLCPCB Part Class: Extended Part; Datasheet: https://atta.szlcsc.com/upload/public/pdf/source/20210308/C40946_6601C147C7095864F145A24DE9501752.pdf; Supplier: LCSC; Connector Type: Micro-B; Standard: USB 2.0; Gender: Female; Number of Ports: 1; Number of Contacts: 5P
X1 = TAXM16M4RDBCCT2T: Type:Surface Mount Crystal Frequency:16MHz Normal temperature Frequency Tolerance:±10ppm Normal temperature Frequency Tolerance:±10ppm Load Capacitance: Frequency Stability:±50ppm Frequency Stability:±50ppm Equivalent Series Resistance(ESR):80Ω Operating; LCSC Part Name: 16MHz ±10ppm 10pF; Supplier Part: C164044; Manufacturer: YJX(雅晶鑫); Supplier Footprint: SMD3225-4P; JLCPCB Part Class: Extended Part; Datasheet: https://atta.szlcsc.com/upload/public/pdf/source/20171225/C164044_15141924890871203411.pdf; Supplier: LCSC; Type: Surface Mount Crystal; Normal temperature Frequency Tolerance: ±10ppm; Frequency Stability: ±50ppm; Equivalent Series Resistance(ESR): 80Ω; Operating Temperature: -40℃~+85℃

## Nets
+5V: C13.2 D1.1(A) SW1.3 U4.3(VIN)
+12V: C1.1 C11.2 C12.2 D2.2(K) P1.23 R11.2
GND: A1.3 A1.4 B1.3 B1.4 C1.2 C2.2 C3.2 C4.1 C5.1 C6.1 C7.1 C8.1 C9.1 C10.2 C11.1 C12.1 C13.1 C14.1 C15.1 C16.1 C17.1 C18.2 C19.1 C20.1 C21.2 DOWN1.3 DOWN1.4 GND.1 H1.2 H1.3 H1.4 LEFT1.3 LEFT1.4 P1.1 P1.2 P1.3 P1.6 P1.7 P1.11 P1.12 P1.16 P1.17 P1.18 P1.19 P1.20 P1.24 R1.1 R4.1 R5.1 R12.1 RIGHT1.3 RIGHT1.4 RST1.3 RST1.4 U1.1(TEMP) U1.3(GND) U2.4(GND) U3.3(GND) U4.1(GND) U5.5(UGnd) U5.15(GND) U5.23(GND) U5.33(PE2 (HWB#)) U5.35(GND) U5.43(GND) UP1.3 UP1.4 USB1.5(GND) X1.2(GND) X1.4(GND)
VCC: C3.1 C4.2 C7.2 C14.2 C15.2 C16.2 C17.2 LED3.2(+) P1.5 R2.1 R3.1 R16.1 U4.2(OUT) U5.14(VCC) U5.24(AVCC) U5.34(VCC) U5.44(AVCC) VCC.1
A_SW: A1.1 A1.2 U5.1(PE6 (INT.6/AIN0))
B+: C6.2 H1.1 SW1.2 U1.5(BAT)
B_SW: B1.1 B1.2 U5.28(PB4(PCINT4/ADC11))
CLK: CLK.1 P1.13 R2.2 U2.6(CLK) U5.9(PB1 (PCINT1/SCLK))
D+: R7.1 U5.4(D+)
D-: R6.1 U5.3(D-)
DOWN_SW: DOWN1.1 DOWN1.2 U5.39(PF4 (ADC4/TCK))
LEFT_SW: LEFT1.1 LEFT1.2 U5.38(PF5 (ADC5/TMS)))
MISO: MISO.1 U2.2(DO) U5.11(PB3 (PDO/PCINT3/MISO))
MOSI: MOSI.1 P1.14 R3.2 U2.5(DI) U5.10(PB2 (PDI/PCINT2/MOSI))
OLED_CS: P1.8 R1.2 U5.26(PD6(T1/OC4D#/ADC9))
OLED_DC: P1.10 U5.25(PD4(ICP1/ADC8))
OLED_RST: P1.9 U5.27(PD7 (T0/OC4D/ADC10))
PIEZO_P1: SP+.1 U5.31(PC6(OC3A/OC4A#))
PIEZO_P2: SP-.1 U5.32(PC7(ICP3/CLK0/OC4A))
RGB_BLUE: R13.2 U5.29(PB5(PCINT5/OC1A/OC4B#/ADC12))
RGB_GREEN: R14.1 U5.12(PB7(PCINT7/OC0A/OC1C/RTS#))
RGB_RED: R15.1 U5.30(PB6(PCINT6/OC1B/OC4B/ADC13))
RIGHT_SW: RIGHT1.1 RIGHT1.2 U5.37(PF6 (ADC6/TDO)
RST: R16.2 RST.1 RST1.1 RST1.2 U5.13(RESET#)
SDA/FLASH_CS: U2.1(CS#) U5.19(PD1 (SDA/INT1))
UP_SW: U5.36(PF7 (ADC7/TDI)) UP1.1 UP1.2
UVCC: C5.2 F1.2 LED1.2(+) LED2.2(A) U1.4(VCC) U1.8(CE) U5.2(UVcc) U5.7(VBus)
Net-(C2-1): C2.1 P1.22
Net-(C8-2): C8.2 C9.2 D1.2(K) L3.1 U3.5(CTRL) U3.6(VIN)
Net-(C10-1): C10.1 R10.1
Net-(C18-1): C18.1 U5.42(AREF)
Net-(C19-2): C19.2 U5.16(XTAL2) X1.3(OSC2)
Net-(C20-2): C20.2 U5.17(XTAL1) X1.1(OSC1)
Net-(C21-1): C21.1 U5.6(UCap)
Net-(D2-1): D2.1(A) L3.2 U3.4(SW)
Net-(F1-1): F1.1 USB1.1(VBUS)
Net-(LED1-1): LED1.1(-) R8.2
Net-(LED2-1): LED2.1(K) R9.2
Net-(LED3-1): LED3.1(-) R13.1
Net-(LED3-3): LED3.3(-) R14.2
Net-(LED3-4): LED3.4(-) R15.2
Net-(P1-21): P1.21 R4.2
Net-(R5-2): R5.2 U1.2(PROG)
Net-(R6-2): R6.2 USB1.2(D-)
Net-(R7-2): R7.2 USB1.3(D+)
Net-(R8-1): R8.1 U1.7(CHRG#)
Net-(R9-1): R9.1 U1.6(STDBY#)
Net-(R10-2): R10.2 U3.2(COMP)
Net-(R11-1): R11.1 R12.2 U3.1(FB)
Net-(U2-3): U2.3(IO2) U2.7(IO3) U2.8(VCC)

Not connected (* = marked no-connect by the designer): P1 4* 15* 25* 26*; SW1 1* 4* 5*; U1 9(EP)*; U3 7(EP)*; U5 8(PB0(SS/PCINT0))* 18(PD0 (OC0B/SCL/INT0))* 20(PD2 (RXD1/INT2))* 21(PD3 (TXD1/INT3))* 22(PD5 (XCK1/CTS#))* 40(PF1 (ADC1))* 41(PF0 (ADC0))*; USB1 4(ID)* 6* 7* 8* 9*

## Notes on the sheet
- 2.42 OLED Connector
- Flash Memory
- Program points
- MegaPocket
- by Megazoid 22-05-2025
- www.youtube.com/@megazoid
- ATmega32U4
- RGB LED
- Boost Converter
- Battery Connector
- Speaker
- Charging Circuit
- Voltage Regulator
- Joystick
- Buttons
- & Switch
- RED
- GREEN
